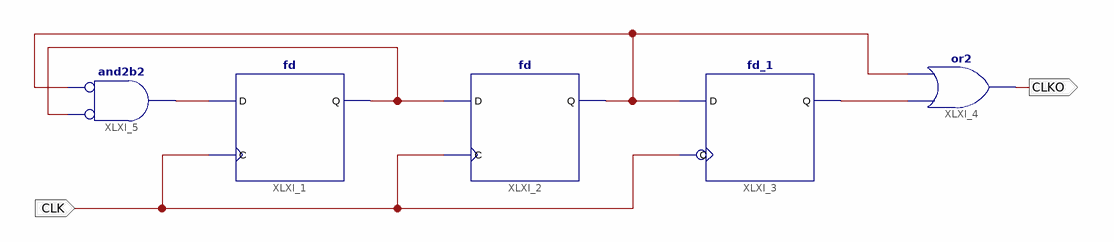
[diagram p0: schematic sheet 1]
// Xilinx ISE schematic clkdiv3.sch (spartan6) as structural Verilog: 5 symbols, 2 ports
module clkdiv3 (
  input  CLK,
  output CLKO
);

  wire XLXN_1, XLXN_4, XLXN_5, XLXN_6;

  fd XLXI_1 (.C(CLK), .D(XLXN_4), .Q(XLXN_6));
  fd XLXI_2 (.C(CLK), .D(XLXN_6), .Q(XLXN_5));
  fd_1 XLXI_3 (.C(CLK), .D(XLXN_5), .Q(XLXN_1));
  or XLXI_4 (CLKO, XLXN_1, XLXN_5);
  and XLXI_5 (XLXN_4, ~XLXN_6, ~XLXN_5);  // and2b2
endmodule
